# Altium schematic sheet tap.SchDoc
size A4
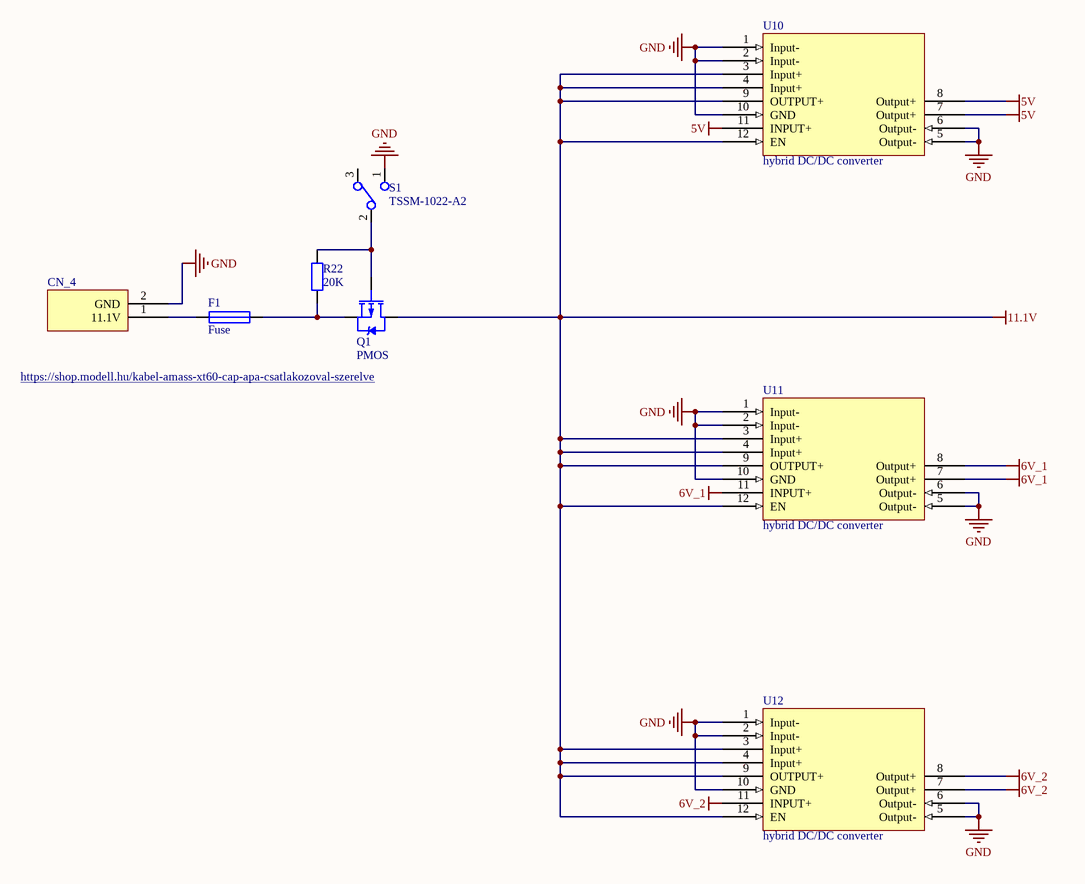
[diagram p0: tap.SchDoc]

## Parts
CN_4  https://shop.modell.hu/kabel-amass-xt60-cap-apa-csatlakozoval-szerelve  [Táp akksihoz]
F1  Fuse  [FP_CONN2_TUSKE_254MM]
Q1  PMOS  [FP_DPAK-TO252]
R22  20K  [FP_0603_RES]
S1  TSSM-1022-A2  [SajatSwitch]
U10  hybrid DC/DC converter  [DC-DC konverter közös]
U11  hybrid DC/DC converter  [DC-DC konverter közös]
U12  hybrid DC/DC converter  [DC-DC konverter közös]

## Nets
5V: U10.7(Output+) U10.8(Output+) U10.11(INPUT+)
6V_1: U11.7(Output+) U11.8(Output+) U11.11(INPUT+)
6V_2: U12.7(Output+) U12.8(Output+) U12.11(INPUT+)
11.1V: Q1.2(D) U10.3(Input+) U10.4(Input+) U10.9(OUTPUT+) U10.12(EN) U11.3(Input+) U11.4(Input+) U11.9(OUTPUT+) U11.12(EN) U12.3(Input+) U12.4(Input+) U12.9(OUTPUT+) U12.12(EN)
GND: CN_4.2(GND) S1.1(C1) U10.1(Input-) U10.2(Input-) U10.5(Output-) U10.6(Output-) U10.10(GND) U11.1(Input-) U11.2(Input-) U11.5(Output-) U11.6(Output-) U11.10(GND) U12.1(Input-) U12.2(Input-) U12.5(Output-) U12.6(Output-) U12.10(GND)
NetCN_4_1: CN_4.1(11.1V) F1.1
NetF1_2: F1.2 Q1.3(S) R22.1
NetQ1_1: Q1.1(G) R22.2 S1.2(C2)

Not connected (* = marked no-connect by the designer): S1 3(C3)

## Library data of the parts
CN_4 = akksi 11.1V: akksi 11.1V, csatlakozó: XT60; supplier: shop.model.hu; reference: https://shop.modell.hu/kabel-amass-xt60-cap-apa-csatlakozoval-szerelve
Q1 = PMOS: MOSFET, P CH
R22 = RES: Resistor; Value: 20K
S1 = SajatSwitch: Reference: 100.264.66; Supplier: Hestore
U10 = DSN-1504-3A_5 / STDN-3A24-ADJ_5: hybrid dc/dc: DSN-1504-3A / STDN-3A24-ADJ; 5V
U11 U12 = DSN-1504-3A_6 / STDN-3A24-ADJ_6: hybrid dc/dc: DSN-1504-3A / STDN-3A24-ADJ; 6V